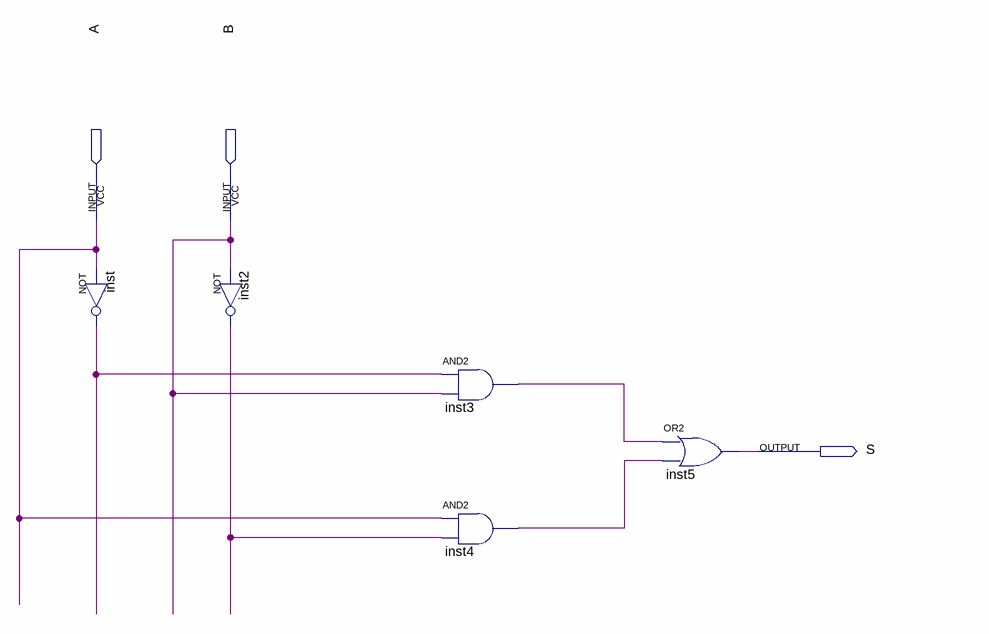
[diagram p0: schematic sheet]
// Quartus schematic exp1.bdf as structural Verilog: 5 symbols, 3 pins
module exp1 (
  input  A,
  input  B,
  output S
);

  wire inst2_out, inst3_out, inst4_out, inst_out;

  not inst (inst_out, A);
  not inst2 (inst2_out, B);
  and inst3 (inst3_out, inst_out, B);
  and inst4 (inst4_out, A, inst2_out);
  or inst5 (S, inst3_out, inst4_out);
endmodule
